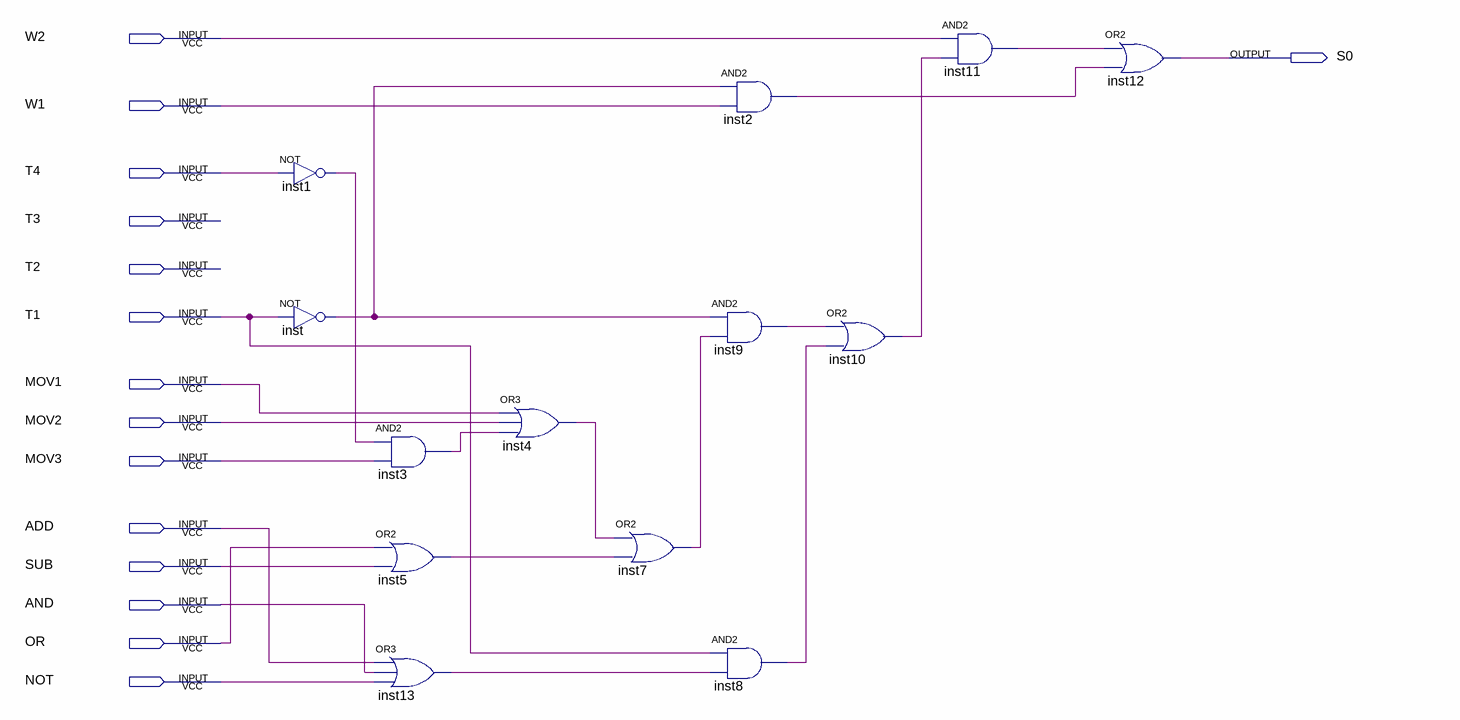
[diagram p0: schematic sheet]
// Quartus schematic S0.bdf as structural Verilog: 13 symbols, 15 pins
module S0 (
  input  W2,
  input  W1,
  input  T4,
  input  T3,
  input  T2,
  input  T1,
  input  MOV1,
  input  MOV2,
  input  MOV3,
  input  ADD,
  input  SUB,
  input  AND,
  input  OR,
  input  NOT,
  output S0
);

  wire inst1_out, inst2_out, inst3_out, inst4_out, inst5_out, inst7_out, inst8_out, inst9_out, inst10_out,
       inst11_out, inst13_out, inst_out;

  not inst1 (inst1_out, T4);
  not inst (inst_out, T1);
  and inst3 (inst3_out, inst1_out, MOV3);
  or inst5 (inst5_out, OR, SUB);
  or inst13 (inst13_out, ADD, AND, NOT);
  or inst4 (inst4_out, MOV1, MOV2, inst3_out);
  or inst7 (inst7_out, inst4_out, inst5_out);
  and inst2 (inst2_out, inst_out, W1);
  and inst9 (inst9_out, inst_out, inst7_out);
  and inst8 (inst8_out, T1, inst13_out);
  or inst10 (inst10_out, inst9_out, inst8_out);
  and inst11 (inst11_out, W2, inst10_out);
  or inst12 (S0, inst11_out, inst2_out);
endmodule
